# Altium project PoweBoard2.PrjPcb
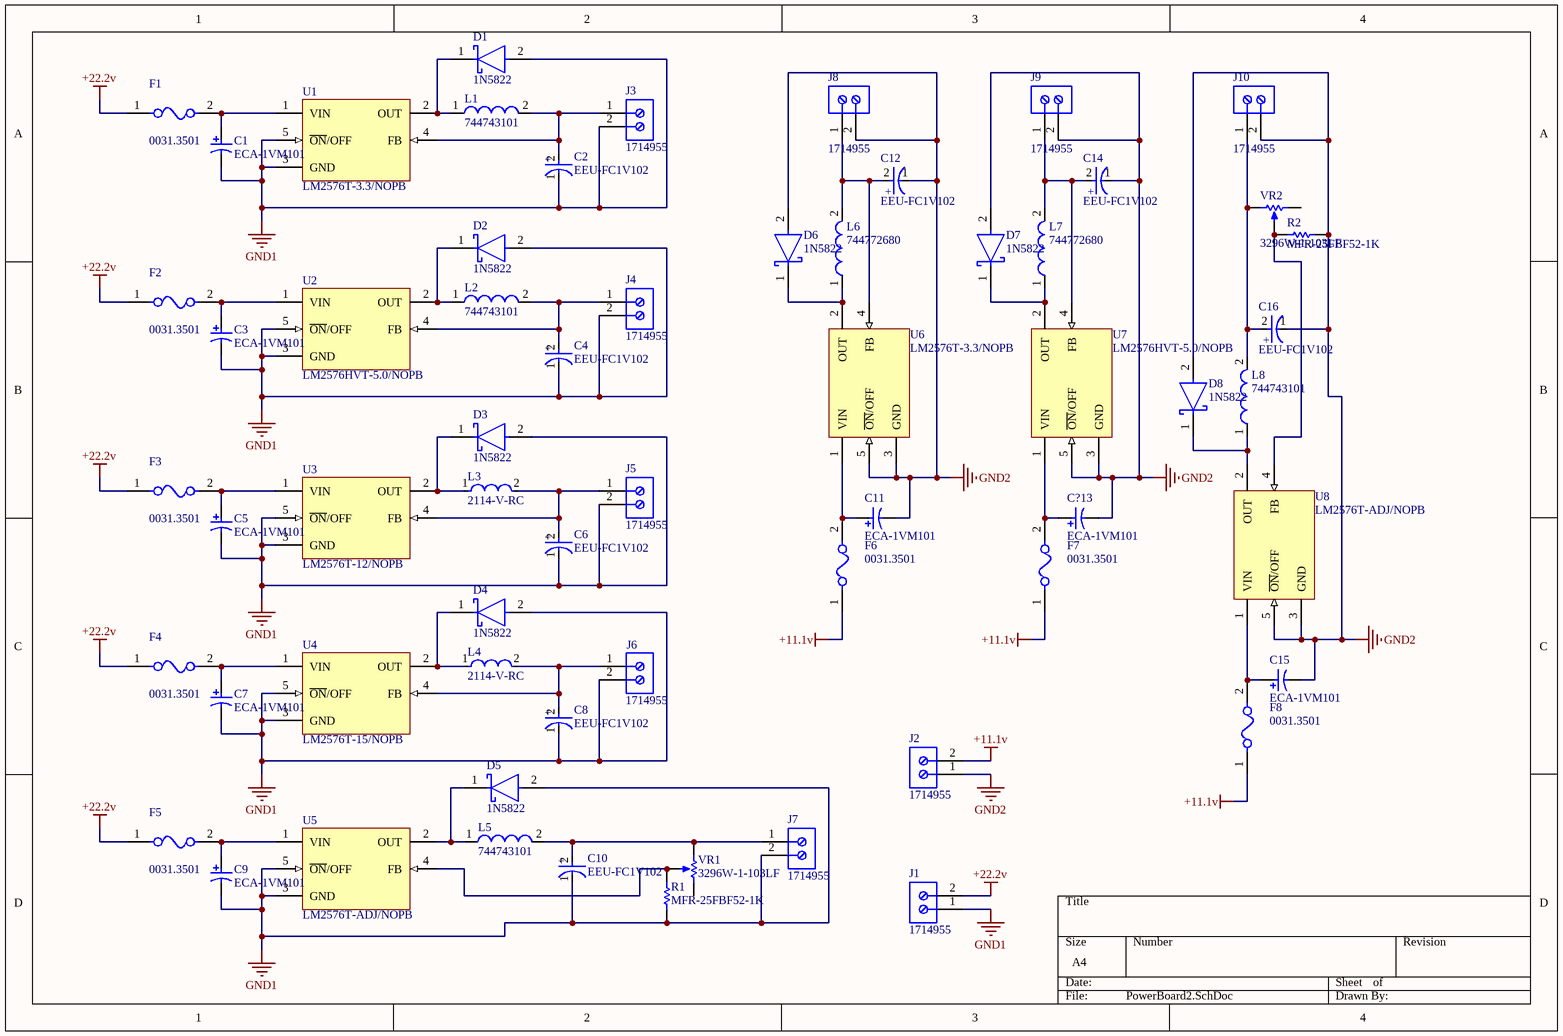
[diagram p0: PowerBoard2.SchDoc]
1 sheet, 62 parts. Net scope: global (net labels, ports and power ports of the same name join across sheets).
Board file: PowerBoard2.PcbDoc

## Sheet PowerBoard2.SchDoc
size A4; SheetNumber: 1; SheetTotal: 1

### Parts
C1  ECA-1VM101  [CAPPR55-250-1120X630X1220]
C2  EEU-FC1V102  [FP-EEU-FC1V102-MFG]
C3  ECA-1VM101  [CAPPR55-250-1120X630X1220]
C4  EEU-FC1V102  [FP-EEU-FC1V102-MFG]
C5  ECA-1VM101  [CAPPR55-250-1120X630X1220]
C6  EEU-FC1V102  [FP-EEU-FC1V102-MFG]
C7  ECA-1VM101  [CAPPR55-250-1120X630X1220]
C8  EEU-FC1V102  [FP-EEU-FC1V102-MFG]
C9  ECA-1VM101  [CAPPR55-250-1120X630X1220]
C10  EEU-FC1V102  [FP-EEU-FC1V102-MFG]
C11  ECA-1VM101  [CAPPR55-250-1120X630X1220]
C12  EEU-FC1V102  [FP-EEU-FC1V102-MFG]
C14  EEU-FC1V102  [FP-EEU-FC1V102-MFG]
C15  ECA-1VM101  [CAPPR55-250-1120X630X1220]
C16  EEU-FC1V102  [FP-EEU-FC1V102-MFG]
C?13  ECA-1VM101  [CAPPR55-250-1120X630X1220]
D1  1N5822  [FP-DO-201AD-MFG]
D2  1N5822  [FP-DO-201AD-MFG]
D3  1N5822  [FP-DO-201AD-MFG]
D4  1N5822  [FP-DO-201AD-MFG]
D5  1N5822  [FP-DO-201AD-MFG]
D6  1N5822  [FP-DO-201AD-MFG]
D7  1N5822  [FP-DO-201AD-MFG]
D8  1N5822  [FP-DO-201AD-MFG]
F1  0031.3501  [FP-0031_3501-MFG]
F2  0031.3501  [FP-0031_3501-MFG]
F3  0031.3501  [FP-0031_3501-MFG]
F4  0031.3501  [FP-0031_3501-MFG]
F5  0031.3501  [FP-0031_3501-MFG]
F6  0031.3501  [FP-0031_3501-MFG]
F7  0031.3501  [FP-0031_3501-MFG]
F8  0031.3501  [FP-0031_3501-MFG]
J1  1714955  [PHOE-1714955_V]
J2  1714955  [PHOE-1714955_V]
J3  1714955  [PHOE-1714955_V]
J4  1714955  [PHOE-1714955_V]
J5  1714955  [PHOE-1714955_V]
J6  1714955  [PHOE-1714955_V]
J7  1714955  [PHOE-1714955_V]
J8  1714955  [PHOE-1714955_V]
J9  1714955  [PHOE-1714955_V]
J10  1714955  [PHOE-1714955_V]
L1  744743101  [WE-TI-LB]
L2  744743101  [WE-TI-LB]
L3  2114-V-RC  [FP-2114-V-RC-MFG]
L4  2114-V-RC  [FP-2114-V-RC-MFG]
L5  744743101  [WE-TI-LB]
L6  744772680  [WE-TI-L]
L7  744772680  [WE-TI-L]
L8  744743101  [WE-TI-LB]
R1  MFR-25FBF52-1K  [RESA60-630X240]
R2  MFR-25FBF52-1K  [RESA60-630X240]
U1  LM2576T-3.3/NOPB  [KC0005A]
U2  LM2576HVT-5.0/NOPB  [KC0005A]
U3  LM2576T-12/NOPB  [KC0005A]
U4  LM2576T-15/NOPB  [KC0005A]
U5  LM2576T-ADJ/NOPB  [KC0005A]
U6  LM2576T-3.3/NOPB  [KC0005A]
U7  LM2576HVT-5.0/NOPB  [KC0005A]
U8  LM2576T-ADJ/NOPB  [KC0005A]
VR1  3296W-1-103LF  [BOUR-3296W]
VR2  3296W-1-103LF  [BOUR-3296W]

### Nets
+11.1v: F6.1 F7.1 F8.1 J2.2
+22.2v: F1.1 F2.1 F3.1 F4.1 F5.1 J1.2
GND1: C1.2 C2.1(C) C3.2 C4.1(C) C5.2 C6.1(C) C7.2 C8.1(C) C9.2 C10.1(C) D1.2(A) D2.2(A) D3.2(A) D4.2(A) D5.2(A) J1.1 J3.2 J4.2 J5.2 J6.2 J7.2 R1.1 U1.3(GND) U1.5(~{ON}/OFF) U2.3(GND) U2.5(~{ON}/OFF) U3.3(GND) U3.5(~{ON}/OFF) U4.3(GND) U4.5(~{ON}/OFF) U5.3(GND) U5.5(~{ON}/OFF)
GND2: C11.2 C12.1(C) C14.1(C) C15.2 C16.1(C) C?13.2 D6.2(A) D7.2(A) D8.2(A) J2.1 J8.2 J9.2 J10.2 R2.1 U6.3(GND) U6.5(~{ON}/OFF) U7.3(GND) U7.5(~{ON}/OFF) U8.3(GND) U8.5(~{ON}/OFF)
NetC1_1: C1.1 F1.2 U1.1(VIN)
NetC2_2: C2.2(A) J3.1 L1.2 U1.4(FB)
NetC3_1: C3.1 F2.2 U2.1(VIN)
NetC4_2: C4.2(A) J4.1 L2.2 U2.4(FB)
NetC5_1: C5.1 F3.2 U3.1(VIN)
NetC6_2: C6.2(A) J5.1 L3.2 U3.4(FB)
NetC7_1: C7.1 F4.2 U4.1(VIN)
NetC8_2: C8.2(A) J6.1 L4.2 U4.4(FB)
NetC9_1: C9.1 F5.2 U5.1(VIN)
NetC10_2: C10.2(A) J7.1 L5.2 VR1.1(CCW)
NetC11_1: C11.1 F6.2 U6.1(VIN)
NetC12_2: C12.2(A) J8.1 L6.2 U6.4(FB)
NetC14_2: C14.2(A) J9.1 L7.2 U7.4(FB)
NetC15_1: C15.1 F8.2 U8.1(VIN)
NetC16_2: C16.2(A) J10.1 L8.2 VR2.1(CCW)
NetC?13_1: C?13.1 F7.2 U7.1(VIN)
NetD1_1: D1.1(C) L1.1 U1.2(OUT)
NetD2_1: D2.1(C) L2.1 U2.2(OUT)
NetD3_1: D3.1(C) L3.1 U3.2(OUT)
NetD4_1: D4.1(C) L4.1 U4.2(OUT)
NetD5_1: D5.1(C) L5.1 U5.2(OUT)
NetD6_1: D6.1(C) L6.1 U6.2(OUT)
NetD7_1: D7.1(C) L7.1 U7.2(OUT)
NetD8_1: D8.1(C) L8.1 U8.2(OUT)
NetR1_2: R1.2 U5.4(FB) VR1.2(S)
NetR2_2: R2.2 U8.4(FB) VR2.2(S)

Not connected (* = marked no-connect by the designer): VR1 3(CW); VR2 3(CW)

### Notes on the sheet
- (in symbol CMP-05427-000052-1) +

### Library data of the parts
C1 C3 C5 C7 C9 C11 C15 C?13 = CMP-1665-00015-4: Aluminum Electrolytic Capacitor (Radial Lead Type), 100 uF, 35 V, -40 to 85 degC, 2-Pin THD, RoHS, Bulk; Manufacturer: Panasonic; Voltage Rating: 35 V; PackageReference: Radial; ComponentLink2URL: http://industrial.panasonic.com/cdbs/www-data/pdf/RDF0000/ABA0000C1047.pdf; DatasheetVersion: 03/2016; REACH SVHC: No SVHC; Mounting Technology: Through Hole; ComponentLink2Description: Datasheet; Packaging: Bulk; Lead Pitch: 2.5 mm; Height: 11.2 mm; Pins: 2; RoHSCompliant: true; Mount: Through Hole; Package Quantity: 200; Min Operating Temperature: -40 degC; Max Operating Temperature: 85 degC; PackageDescription: 2-Pin Through Hole Device, Dia 6.3 mm, Body Length 11.2 mm; ComponentLink1Description: Manufacturer URL; Length: 11.2 mm; ComponentLink1URL: http://www.panasonic.com/
C2 C4 C6 C8 C10 C12 C14 C16 = CMP-05427-000052-1: CAP ALUM 1000UF 20% 35V RADIAL; Impedance: 30mR; Capacitance: 1mF; Life (Hours): 5000Hour; Leakage Current: 3uA; Ripple Current: 1.945A; Lead Diameter: 0.6mm; Dielectric Material: Aluminium; Polarity: Polar; Diameter: 12.5mm; Voltage Rating (DC): 35V; Package Quantity: 200; Tolerance: 20%; RoHS Compliant: Yes; REACH SVHC: No SVHC; Contact Plating: Tin; Mount: Through Hole; Height - Seated (Max): 0.984inch; Voltage Rating: 35V; Radiation Hardening: No; Lead Pitch: 5mm; Height: 25mm; Termination: Radial; Packaging: Bulk; Number of Pins: 2; Voltage: 35V; Series: FC; Construction: RADIAL; Max Operating Temperature: 105°C; Case/Package: Radial; Min Operating Temperature: -55°C; ESR (Equivalent Series Resistance): 30mR; Length: 25mm; Lead Free: Lead Free
D1-D8 = CMP-12187-000025-1: DIODE SCHOTTKY 40V 3A DO201AD; Manufacturer: STMicroelectronics; Max Junction Temp: +150°C; Peak Reverse Current: 2mA; Max Surge Forward Current: 80A; Temperature Range High: +150°C; Automotive: No; RoHS: TRUE; ComponentLink2Description: Datasheet; Manufacturer Part Number: 1N5822; Lead Free: Yes; Octopart: https://octopart.com/1n5822-stmicroelectronics-323225; Device Class L2: Diodes; Max Repetitive Reverse Voltage: 40V; Temperature: to +150°C; Height: 5.3mm; Category: Diode; Digikey Description: DIODE SCHOTTKY 40V 3A DO201AD; ComponentLink2URL: https://www.st.com/resource/en/datasheet/1n5822.pdf; Device Class L3: Schottky Diodes; Device Class L1: Discrete Semiconductors; Forward Current: 3A; Mouser Description: Schottky Diodes & Rectifiers Vr/40V Io/3A BULK; Package: DO-201AD
F1-F8 = CMP-26292-000003-1: FUSE HOLDER CART 250V 6.3A PCB; Manufacturer: Schurter; Number Of Fuses: 1; Conn Orientation: Right Angle; Automotive: No; Ambient Temperature Range Low: -40°C; Device Class L1: Circuit Protection; Lead Free: Yes; ComponentLink2URL: https://us.schurter.com/bundles/snceschurter/epim/_ProdPool_/newDS/en/typ_FAS.pdf; Octopart: https://octopart.com/0031.3501-schurter-742824; Device Class L3: unset; ComponentLink2Description: Datasheet; Manufacturer Part Number: 0031.3501; Voltage Rating Ac: 250V; Digikey Description: FUSE HOLDER CART 250V 6.3A PCB; RoHS: TRUE; Mouser Description: Fuse Holder FAS F'GRIP/SLOT; Height: 10mm; Category: Fuse; Voltage Rating Dc: 250V; Device Class L2: Fuse Holders; Package: 0; Ambient Temperature Range High: +85°C; Fuse Current: 6.3A
J1-J10 = CMP-2000-05797-1: PC Terminal Block, Pitch 6.35 mm, 1 x 2 Position, Height 21.5 mm, Tail Lenght 5.1 mm, RoHS, Bulk; Manufacturer: Phoenix Contact; Package Description: PC Terminal Block, Pitch 6.35 mm, 1 x 2 Position, Height 21.5 mm, Tail Lenght 5.1 mm; Datasheet URL: http://media.digikey.com/pdf/Data%20Sheets/Phoenix%20Contact%20PDFs/1714955.pdf; Package Reference: 1714955; Manufacturer URL: http://www.phoenixcontact.com/; Datasheet Version: 02/2010; Mounting Technology: ThroughHole
L1 L2 L5 L8 = CMP-0225-00065-1: Radial Leaded Wire Wound Inductor WE-TI, L = 100 µH; Inductance: 100 ÂµH; ComponentLink2URL: http://www.we-online.de/katalog/media/pdf/744743101.pdf; ComponentLink2Description: Datasheet; PackageReference: WE-TI-LB; ComponentLink1Description: Manufacturer Link; PackageDescription: THT Inductor, 2-Leads, Body 8.0 x 8.0 mm; PackageVersion: 2004; ComponentLink1URL: http://www.we-online.com; DatasheetVersion: ver 3, Nov-2004
L3 L4 = CMP-07248-000012-1: FIXED IND 150UH 3.4A 62 MOHM TH; Manufacturer: Bourns; Tolerance: 15%; Test Frequency: 1kHz; Shielding: true; Series Resistance: 0.062Ω; Temperature: -55°C to +105°C; Category: Ind; Height: 0.86inch; Device Class L3: Fixed Inductors; Digikey Description: FIXED IND 150UH 3.4A 62 MOHM TH; Device Class L2: Inductors; Composition: Wirewound; Device Class L1: Passive Components; Package: 2114-V-RC; Inductance: 150uH; Temperature Range High: +105°C; ComponentLink2URL: https://www.bourns.com/docs/Product-Datasheets/2100_series.pdf; Manufacturer Part Number: 2114-V-RC; Value: 150uH; RoHS: TRUE; Automotive: No; Octopart: https://octopart.com/2114-v-rc-bourns-39574085; Mouser Description: Fixed Inductors 150uH 15% Vertical; Temperature Range Low: -55°C; ComponentLink2Description: Datasheet; Lead Free: Yes; Rms Current: 3.4A
L6 L7 = CMP-0225-00055-1: Radial Leaded Wire Wound Inductor WE-TI, L = 68.0 µH; Inductance: 68.0 ÂµH; ComponentLink1Description: Manufacturer Link; ComponentLink2URL: http://www.we-online.de/katalog/media/pdf/744772680.pdf; PackageDescription: THT Inductor, 2-Leads, Body 7.8 x 7.8 mm; PackageVersion: 2006; ComponentLink2Description: Datasheet; PackageReference: WE-TI-L; DatasheetVersion: May-2006; ComponentLink1URL: http://www.we-online.com
R1 R2 = CMP-1659-00075-1: Axial Resistor, 1 KOhm, +/- 1%, 250 mW, -55 to 155 degC, 2-Pin THD, RoHS, Bulk; Voltage Rating: 250 V; Resistance: 10 kohm; Power Rating: 250 mW; ComponentLink2Description: Datasheet; RoHSCompliant: true; PackageReference: MFR-25; Case\Package: Axial; Max Operating Temperature: 155 degC; DatasheetVersion: Apr-13; Tolerance: 1%; ComponentLink1URL: http://www.yageo.com/; Length: 0.248 inch; ComponentLink2URL: http://www.yageo.com/documents/recent/Yageo%20LR_MFR_2013.pdf; Packaging: Bulk; Package Quantity: 200; PackageDescription: 2-Pin Axial Lead, Dia 2.4 mm, Body Length 6.3 mm; Min Operating Temperature: -55 degC; ComponentLink1Description: Manufacturer URL
U1 U6 = CMP-0069-01995-3: SIMPLE SWITCHER® 3A Step-Down Voltage Regulator, 5-pin TO-220, Pb-Free; Manufacturer: Texas Instruments; PowerWise: N; PackageTopMarking: NSUZXYTTE#*LM2576T*-3.3 P+; CompType: Switcher; ComponentLink1URL: http://www.ti.com/general/docs/lit/getliterature.tsp?genericPartNumber=LM2576&fileType=pdf; PackageDescription: TO-220, Molded, 5 Lead, Straight; PackageReference: KC0005A; RoHS: Y; ComponentLink1Description: Datasheet URL; Code_JEDEC: TO-220-AB; PinCount: 5
U2 U7 = CMP-0069-01992-3: SIMPLE SWITCHER® 3A Step-Down Voltage Regulator, 5-pin TO-220, Pb-Free; Manufacturer: Texas Instruments; PowerWise: N; PackageTopMarking: NSUZXYTTE#*LM2576HVT*-5.0 P+; Code_JEDEC: TO-220-AB; PackageReference: KC0005A; CompType: Switcher; PinCount: 5; RoHS: Y; PackageDescription: TO-220, Molded, 5 Lead, Straight; ComponentLink1URL: http://www.ti.com/general/docs/lit/getliterature.tsp?genericPartNumber=LM2576HV&fileType=pdf; ComponentLink1Description: Datasheet URL
U3 = CMP-0069-01985-3: SIMPLE SWITCHER® 3A Step-Down Voltage Regulator, 5-pin TO-220, Pb-Free; Manufacturer: Texas Instruments; PackageTopMarking: NSUZXYTTE#*LM2576T*-12 P+; PowerWise: N; CompType: Switcher; PackageReference: KC0005A; PinCount: 5; ComponentLink1Description: Datasheet URL; ComponentLink1URL: http://www.ti.com/general/docs/lit/getliterature.tsp?genericPartNumber=LM2576&fileType=pdf; PackageDescription: TO-220, Molded, 5 Lead, Straight; RoHS: Y; Code_JEDEC: TO-220-AB
U4 = CMP-0069-01989-3: SIMPLE SWITCHER® 3A Step-Down Voltage Regulator, 5-pin TO-220, Pb-Free; Manufacturer: Texas Instruments; PackageTopMarking: NSUZXYTTE#*LM2576T*-15 P+; PowerWise: N; PackageReference: KC0005A; PinCount: 5; ComponentLink1URL: http://www.ti.com/general/docs/lit/getliterature.tsp?genericPartNumber=LM2576&fileType=pdf; CompType: Switcher; PackageDescription: TO-220, Molded, 5 Lead, Straight; Code_JEDEC: TO-220-AB; ComponentLink1Description: Datasheet URL; RoHS: Y
U5 U8 = CMP-0069-02005-3: SIMPLE SWITCHER® 3A Step-Down Voltage Regulator, 5-pin TO-220, Pb-Free; Manufacturer: Texas Instruments; PowerWise: N; PackageTopMarking: NSUZXYTTE#*LM2576T*-ADJ P+; CompType: Switcher; PinCount: 5; PackageReference: KC0005A; RoHS: Y; Code_JEDEC: TO-220-AB; ComponentLink1URL: http://www.ti.com/general/docs/lit/getliterature.tsp?genericPartNumber=LM2576&fileType=pdf; ComponentLink1Description: Datasheet URL; PackageDescription: TO-220, Molded, 5 Lead, Straight
VR1 VR2 = CMP-1747-00001-1: Square Trimpot(R) Trimming Potentiometer, 10 KOhm, +/- 10%, 0.5 W, -55 to 125 degC, 3-Pin THD, RoHS, Tube; Voltage Rating: 75 V; Resistance: 120 Ohm; Tolerance: 1%; Power Rating: 100 mW; Case\Package: 0603; Type (Resistor): Thick Film; PackageDescription: 3-Pin Through Hole Device, Body 9.53 x 4.83 mm, Pitch 2.54 mm; RoHSCompliant: true; Package Quantity: 5000; Case Code (Metric): 1608; PackageReference: 3296W; ComponentLink2Description: Datasheet; REACH SVHC: Unknown; Case Code (Imperial): 0603; ComponentLink1URL: http://www.bourns.com/; Width: 0.85 mm; Radiation Hardening: No; Min Operating Temperature: -55 degC; Mount: Surface Mount; ComponentLink1Description: Manufacturer URL; Max Operating Temperature: 155 degC; Weight: 7.1E-05 oz; Pins: 2; DatasheetVersion: May-16; Packaging: Tape and Reel; Height: 0.45 mm; Length: 1.55 mm; ComponentLink2URL: http://www.bourns.com/docs/Product-Datasheets/3296.pdf